# Altium project MIXR Input System.PrjPcb
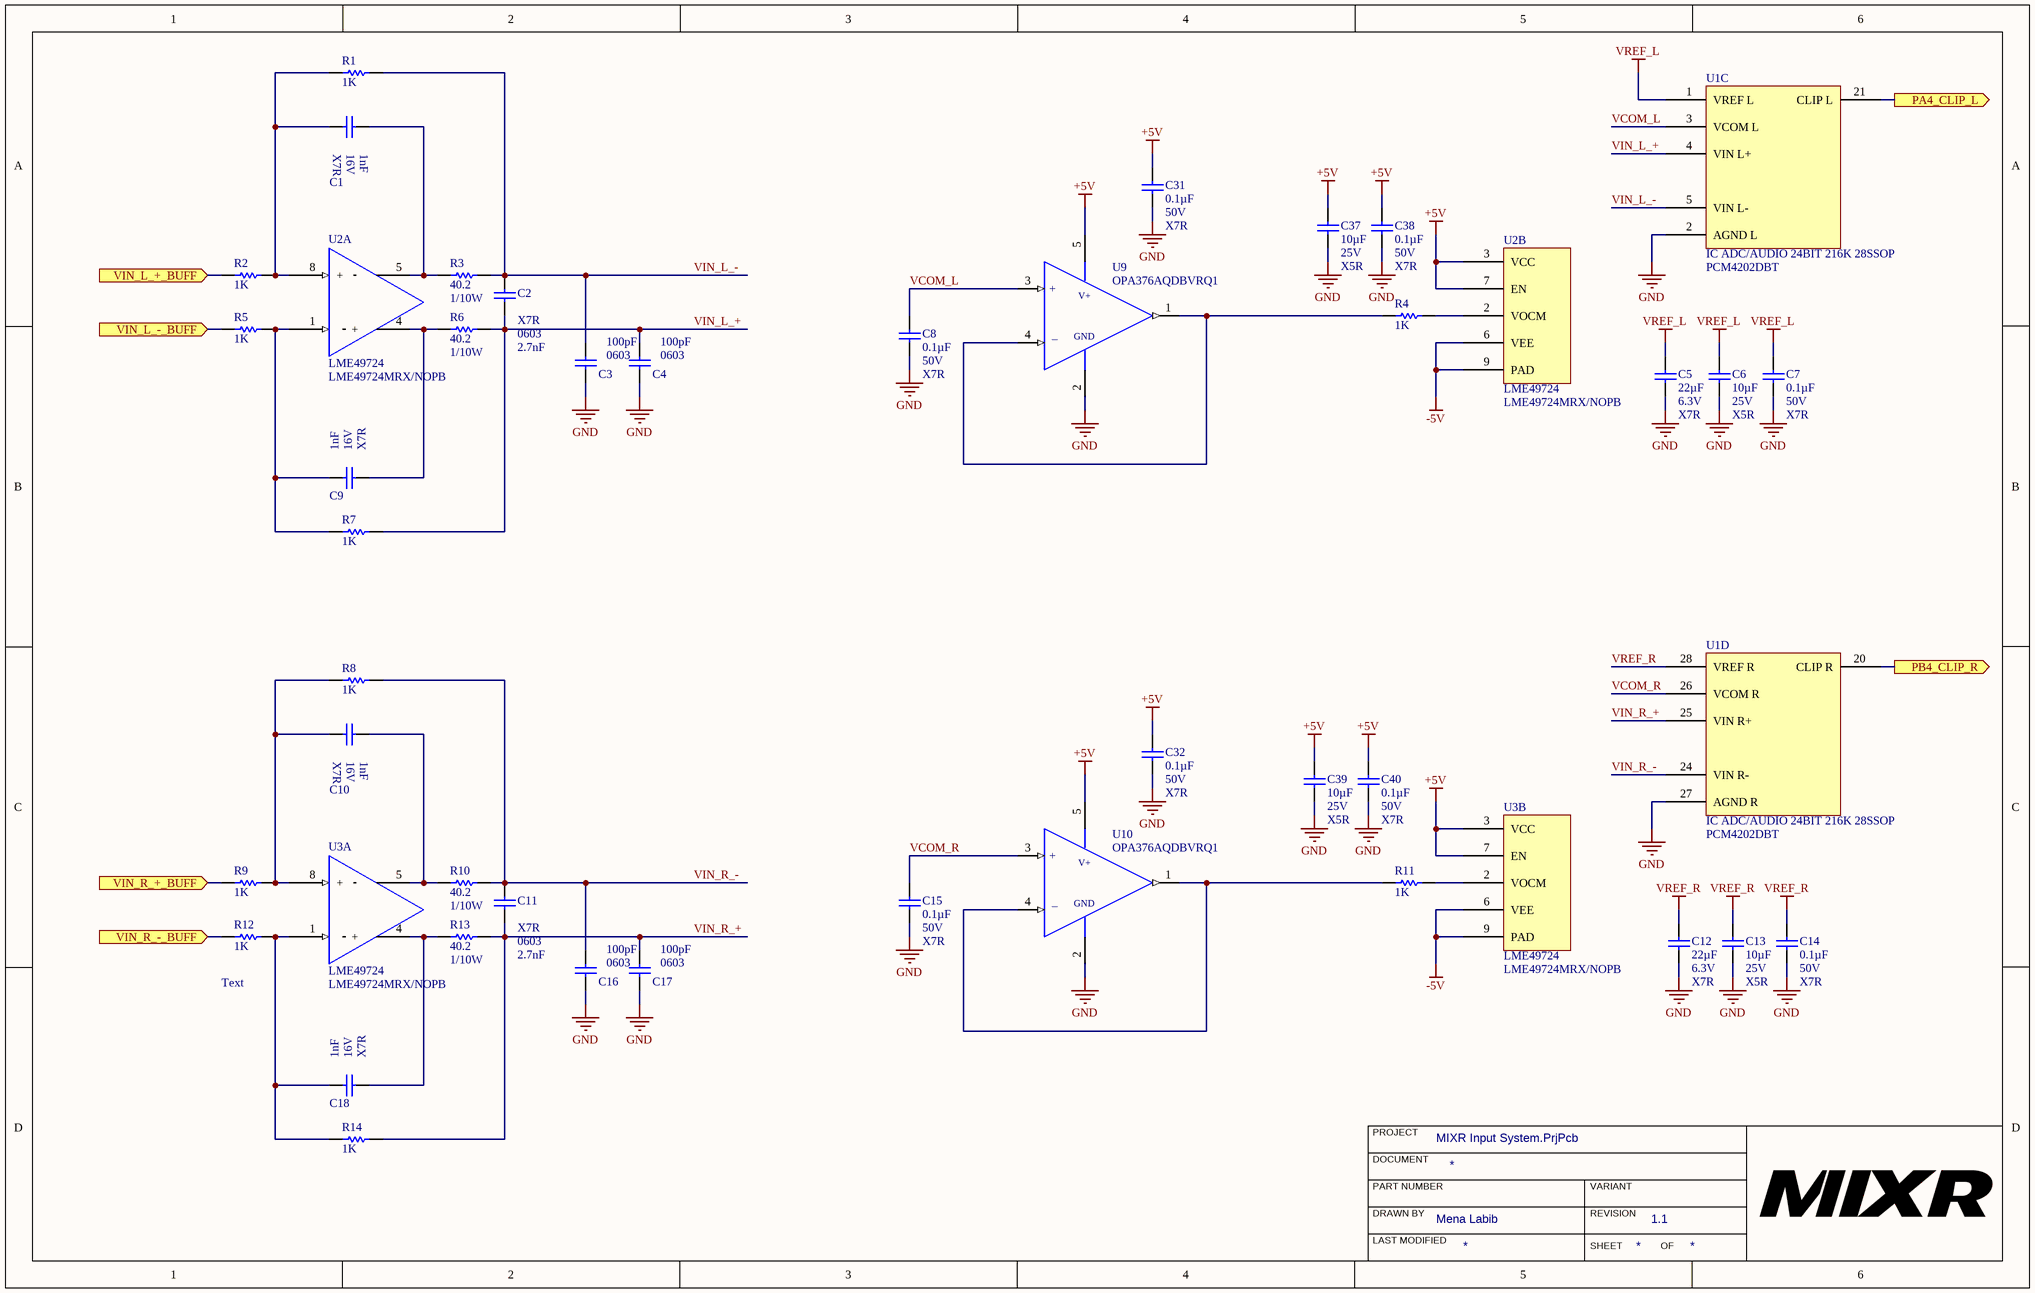
[diagram p0: MIXR Input System - Buffer.SchDoc]
ProjectRevision: 1.1; ProjectAuthor: Mena Labib
2 sheets, 69 parts. Net scope: flat (ports and power ports of the same name join across sheets).
Board file: MIXR Input System.PcbDoc
Sheets:
  MIXR Input System - Buffer.SchDoc
  MIXR Input System - input.SchDoc

## Sheet MIXR Input System - Buffer.SchDoc
size B

### Parts
C1  CAP CER 1NF 16V 10% X7R 0603  [CAP, 0603]  (value not drawn)
C2  Dielectric: X7R  Case Code (Imperial): 0603  Capacitance: 2.7nF  [CAP, 0603]  (hidden comment: CAP CER 2700PF 50V X7R 0603)
C3  Case Code (Imperial): 0603  Capacitance: 100pF  [CAP, 0603]  (hidden comment: CAP CER 100PF 50V C0G/NP0 0603)
C4  Case Code (Imperial): 0603  Capacitance: 100pF  [CAP, 0603]  (hidden comment: CAP CER 100PF 50V C0G/NP0 0603)
C5  Capacitance: 22µF  Voltage: 6.3V  Temperature Coefficient: X7R  [CAP, 1206]  (hidden comment: CAP CER 22UF 6.3V ±10% X7R 1206)
C6  Capacitance: 10µF  Voltage: 25V  Temperature Coefficient: X5R  [CAP, 0603]  (hidden comment: CAP CER 10uF 25V 20% X5R 0603)
C7  Capacitance: 0.1µF  Voltage: 50V  Temperature Coefficient: X7R  [CAP, 0603]  (hidden comment: CAP CER 0.1UF 50V 10% X7R 0603)
C8  Capacitance: 0.1µF  Voltage: 50V  Temperature Coefficient: X7R  [CAP, 0603]  (hidden comment: CAP CER 0.1UF 50V 10% X7R 0603)
C9  CAP CER 1NF 16V 10% X7R 0603  [CAP, 0603]  (value not drawn)
C10  CAP CER 1NF 16V 10% X7R 0603  [CAP, 0603]  (value not drawn)
C11  Dielectric: X7R  Case Code (Imperial): 0603  Capacitance: 2.7nF  [CAP, 0603]  (hidden comment: CAP CER 2700PF 50V X7R 0603)
C12  Capacitance: 22µF  Voltage: 6.3V  Temperature Coefficient: X7R  [CAP, 1206]  (hidden comment: CAP CER 22UF 6.3V ±10% X7R 1206)
C13  Capacitance: 10µF  Voltage: 25V  Temperature Coefficient: X5R  [CAP, 0603]  (hidden comment: CAP CER 10uF 25V 20% X5R 0603)
C14  Capacitance: 0.1µF  Voltage: 50V  Temperature Coefficient: X7R  [CAP, 0603]  (hidden comment: CAP CER 0.1UF 50V 10% X7R 0603)
C15  Capacitance: 0.1µF  Voltage: 50V  Temperature Coefficient: X7R  [CAP, 0603]  (hidden comment: CAP CER 0.1UF 50V 10% X7R 0603)
C16  Case Code (Imperial): 0603  Capacitance: 100pF  [CAP, 0603]  (hidden comment: CAP CER 100PF 50V C0G/NP0 0603)
C17  Case Code (Imperial): 0603  Capacitance: 100pF  [CAP, 0603]  (hidden comment: CAP CER 100PF 50V C0G/NP0 0603)
C18  CAP CER 1NF 16V 10% X7R 0603  [CAP, 0603]  (value not drawn)
C31  Capacitance: 0.1µF  Voltage: 50V  Temperature Coefficient: X7R  [CAP, 0603]  (hidden comment: CAP CER 0.1UF 50V 10% X7R 0603)
C32  Capacitance: 0.1µF  Voltage: 50V  Temperature Coefficient: X7R  [CAP, 0603]  (hidden comment: CAP CER 0.1UF 50V 10% X7R 0603)
C37  Capacitance: 10µF  Voltage: 25V  Temperature Coefficient: X5R  [CAP, 0603]  (hidden comment: CAP CER 10uF 25V 20% X5R 0603)
C38  Capacitance: 0.1µF  Voltage: 50V  Temperature Coefficient: X7R  [CAP, 0603]  (hidden comment: CAP CER 0.1UF 50V 10% X7R 0603)
C39  Capacitance: 10µF  Voltage: 25V  Temperature Coefficient: X5R  [CAP, 0603]  (hidden comment: CAP CER 10uF 25V 20% X5R 0603)
C40  Capacitance: 0.1µF  Voltage: 50V  Temperature Coefficient: X7R  [CAP, 0603]  (hidden comment: CAP CER 0.1UF 50V 10% X7R 0603)
R1  1K  [RES, 0603]
R2  1K  [RES, 0603]
R3  Resistance: 40.2  Power: 1/10W  [RES, 0603]  (hidden comment: RES 40.2 OHM 0.5% 1/10W 0603)
R4  1K  [RES, 0603]
R5  1K  [RES, 0603]
R6  Resistance: 40.2  Power: 1/10W  [RES, 0603]  (hidden comment: RES 40.2 OHM 0.5% 1/10W 0603)
R7  1K  [RES, 0603]
R8  1K  [RES, 0603]
R9  1K  [RES, 0603]
R10  Resistance: 40.2  Power: 1/10W  [RES, 0603]  (hidden comment: RES 40.2 OHM 0.5% 1/10W 0603)
R11  1K  [RES, 0603]
R12  1K  [RES, 0603]
R13  Resistance: 40.2  Power: 1/10W  [RES, 0603]  (hidden comment: RES 40.2 OHM 0.5% 1/10W 0603)
R14  1K  [RES, 0603]
U1  IC ADC/AUDIO 24BIT 216K 28SSOP  Manufacturer Part Number: PCM4202DBT  [IC ADC 24 BIT AUDIO 216 KHZ SSOP-28]  (parts C,D of 4)
U2  LME49724  Manufacturer Part Number: LME49724MRX/NOPB  [IC OP AMP AUDIO LME49724 8-SOIC]  (parts A,B of 2)
U3  LME49724  Manufacturer Part Number: LME49724MRX/NOPB  [IC OP AMP AUDIO LME49724 8-SOIC]  (parts A,B of 2)
U9  Manufacturer Part Number: OPA376AQDBVRQ1  [IC OP AMP GP RR 10MHZ SOT-23-5]  (hidden comment: IC OP AMP GEN PURPOSE RR 5.5MHZ SOT-23-5)
U10  Manufacturer Part Number: OPA376AQDBVRQ1  [IC OP AMP GP RR 10MHZ SOT-23-5]  (hidden comment: IC OP AMP GEN PURPOSE RR 5.5MHZ SOT-23-5)

### Ports
PA4_CLIP_L (out), PB4_CLIP_R (out), VIN_L_+_BUFF (in), VIN_L_-_BUFF (in), VIN_R_+_BUFF (in), VIN_R_-_BUFF (in)

### Nets
+5V: C31.1 C32.1 C37.1 C38.1 C39.1 C40.1 U2.3(VCC) U2.7(EN) U3.3(VCC) U3.7(EN) U9.5(VDD) U10.5(VDD)
-5V: U2.6(VEE) U2.9(PAD) U3.6(VEE) U3.9(PAD)
GND: C3.2 C4.2 C5.2 C6.2 C7.2 C8.2 C12.2 C13.2 C14.2 C15.2 C16.2 C17.2 C31.2 C32.2 C37.2 C38.2 C39.2 C40.2 U1.2(AGND_L) U1.27(AGND_R) U9.2(VSS) U10.2(VSS)
VREF_L: C5.1 C6.1 C7.1 U1.1(VREF_L)
VREF_R: C12.1 C13.1 C14.1 U1.28(VREF_R)
PA4: U1.21(CLIP_L) ; port PA4_CLIP_L
PB4: U1.20(CLIP_R) ; port PB4_CLIP_R
VCOM_L: C8.1 U1.3(VCOM_L) U9.3(+IN)
VCOM_R: C15.1 U1.26(VCOM_R) U10.3(+IN)
VIN_L_+: C2.2 C4.1 R6.2 R7.2 U1.4(VIN_L+)
VIN_L_+_BUFF: R2.1 ; port VIN_L_+_BUFF
VIN_L_-: C2.1 C3.1 R1.2 R3.2 U1.5(VIN_L-)
VIN_L_-_BUFF: R5.1 ; port VIN_L_-_BUFF
VIN_R_+: C11.2 C17.1 R13.2 R14.2 U1.25(VIN_R+)
VIN_R_+_BUFF: R9.1 ; port VIN_R_+_BUFF
VIN_R_-: C11.1 C16.1 R8.2 R10.2 U1.24(VIN_R-)
VIN_R_-_BUFF: R12.1 ; port VIN_R_-_BUFF
NetC1_1: C1.1 R3.1 U2.5(-)
NetC1_2: C1.2 R1.1 R2.2 U2.8(+)
NetC9_1: C9.1 R5.2 R7.1 U2.1(-)
NetC9_2: C9.2 R6.1 U2.4(+)
NetC10_1: C10.1 R10.1 U3.5(-)
NetC10_2: C10.2 R8.1 R9.2 U3.8(+)
NetC18_1: C18.1 R12.2 R14.1 U3.1(-)
NetC18_2: C18.2 R13.1 U3.4(+)
NetR4_1: R4.1 U9.1(OUTPUT) U9.4(-IN)
NetR4_2: R4.2 U2.2(VOCM)
NetR11_1: R11.1 U10.1(OUTPUT) U10.4(-IN)
NetR11_2: R11.2 U3.2(VOCM)

### Notes on the sheet
- (near R12) Text
- PROJECT
- DOCUMENT
- DRAWN BY
- LAST MODIFIED
- PART NUMBER
- REVISION
- SHEET
- VARIANT
- OF
- (in symbol CAP CER 1NF 16V 10% X7R 0603) X7R; 16V; 1nF
- (in symbol IC OP AMP GEN PURPOSE RR 5.5MHZ SOT-23-5) +; V+; GND; _

### Library data of the parts
C1 C9 C10 C18 = CAP CER 1NF 16V 10% X7R 0603: 1000pF ±10% 16V Ceramic Capacitor X7R 0603 (1608 Metric); Manufacturer: KEMET; Manufacturer Part Number: C0603C102K4RECAUTO; Supplier 1: Digi-Key; RoHS: No; Stock 1: 7692; Pricing 1: 1 = 0.19000, 10 = 0.13200, 100 = 0.06210, 500 = 0.04356, 1000 = 0.03606 (USD); ComponentLink1URL: https://api.kemet.com/component-edge/download/datasheet/C0603C102K4RECAUTO.pdf?src-supplier=Digi-Key; ComponentLink1Description: https://api.kemet.com/component-edge/download/datasheet/C0603C102K4RECAUTO.pdf?src-supplier=Digi-Key; Supplier Part Number 1: 399-17878-1-ND
C2 C11 = CAP CER 2700PF 50V X7R 0603: 2700pF ±10% 50V Ceramic Capacitor X7R 0603 (1608 Metric); Manufacturer: KEMET; Manufacturer Part Number: C0603C272K5RACTU; Supplier 1: Digi-Key; RoHS: Yes; Stock 1: 166011; Pricing 1: 1 = 0.11000, 10 = 0.08200, 100 = 0.03660, 500 = 0.02614, 1000 = 0.02054 (USD); Mount: Surface Mount; Case/Package: 0603; Number of Pins: 2; Case Code (Metric): 1608; Dielectric Material: Ceramic; Min Operating Temperature: -55°C; Max Operating Temperature: 125°C; Voltage Rating: 50V; Tolerance: 10%; Packaging: Tape and Reel; Voltage Rating (DC): 50V; Package Quantity: 1; Termination: SMD/SMT; Voltage: 50V; Length: 1.6mm; Height: 0.8mm; Width: 0.031inch; Thickness: 0.034inch; Lead Pitch: 0.7mm; Depth: 0.8mm; Radiation Hardening: No; REACH SVHC: No SVHC; ComponentLink1URL: https://datasheet.ciiva.com/18192/getdatasheetpartid-321287-18192955.pdf?src-supplier=Verical; ComponentLink1Description: https://datasheet.ciiva.com/18192/getdatasheetpartid-321287-18192955.pdf?src-supplier=Verical; ComponentLink2URL: https://datasheet.ciiva.com/7823/1633156-7823726.pdf?src-supplier=Element14; ComponentLink2Description: https://datasheet.ciiva.com/7823/1633156-7823726.pdf?src-supplier=Element14; ComponentLink3URL: https://datasheet.ciiva.com/7823/1633156-7823727.pdf?src-supplier=Element14; ComponentLink3Description: https://datasheet.ciiva.com/7823/1633156-7823727.pdf?src-supplier=Element14; Supplier Part Number 1: 399-7890-1-ND
C3 C4 C16 C17 = CAP CER 100PF 50V C0G/NP0 0603: 100pF ±1% 50V Ceramic Capacitor C0G, NP0 0603 (1608 Metric); Manufacturer: Kyocera AVX; Manufacturer Part Number: 06035A101FAT2A; Supplier 1: Digi-Key; Stock 1: 176069; Pricing 1: 1=0.24, 10=0.161, 100=0.0814, 500=0.0557, 1000=0.0493 (USD); Mount: Surface Mount; Case/Package: 0603; Case Code (Metric): 1608; Min Operating Temperature: -55°C; Max Operating Temperature: 125°C; Tolerance: 1%; Packaging: Tape and Reel; Voltage Rating: 50V; Package Quantity: 1; Voltage Rating (DC): 50V; Dielectric: C0G; Termination: SMD/SMT; Voltage: 50V; Length: 1.6mm; Height: 0.86mm; Width: 0.81mm; Thickness: 0.035inch; Depth: 0.81mm; Radiation Hardening: No; REACH SVHC: No SVHC; Lead Free: Lead Free; ComponentLink1URL: https://datasheet.ciiva.com/22682/1796416-22682854.pdf; ComponentLink1Description: https://datasheet.ciiva.com/22682/1796416-22682854.pdf; ComponentLink2URL: https://datasheet.ciiva.com/150/ccog-150746.pdf; ComponentLink2Description: https://datasheet.ciiva.com/150/ccog-150746.pdf; ComponentLink3URL: https://datasheet.ciiva.com/150/ccog-150747.pdf; ComponentLink3Description: https://datasheet.ciiva.com/150/ccog-150747.pdf; ComponentLink4URL: https://datasheet.ciiva.com/150/ccog-150748.pdf; ComponentLink4Description: https://datasheet.ciiva.com/150/ccog-150748.pdf; ComponentLink5URL: https://datasheet.ciiva.com/28585/1796416-28585980.pdf; ComponentLink5Description: https://datasheet.ciiva.com/28585/1796416-28585980.pdf; ComponentLink6URL: https://datasheet.ciiva.com/16300/ccog-16300413.pdf; ComponentLink6Description: https://datasheet.ciiva.com/16300/ccog-16300413.pdf; ComponentLink7URL: https://datasheet.ciiva.com/17492/ccog-17492189.pdf; ComponentLink7Description: https://datasheet.ciiva.com/17492/ccog-17492189.pdf; Supplier Part Number 1: 478-6202-1-ND
C5 C12 = CAP CER 22UF 6.3V ±10% X7R 1206: 22µF ±10% 6.3V Ceramic Capacitor X7R 1206 (3216 Metric); Manufacturer 1: Murata Electronics North America; Manufacturer Part Number 1: GRM31CR70J226KE19L; Supplier 1: Digi-Key; Supplier Part Number 1: 490-6515-1-ND; Packaging: Cut Tape (CT); Part Status: Active; Operating Temperature: -55°C ~ 125°C; Ratings: -; Mounting Type: Surface Mount, MLCC; Package / Case: 1206 (3216 Metric); Size / Dimension: 0.126" L x 0.063" W (3.20mm x 1.60mm); Height - Seated (Max): -; Thickness (Max): 0.071" (1.80mm); Lead Spacing: -; Lead Style: -; ComponentLink1URL: http://www.murata.com/~/media/webrenewal/support/library/catalog/products/capacitor/mlcc/c02e.ashx; ComponentLink1Description: http://www.murata.com/~/media/webrenewal/support/library/catalog/products/capacitor/mlcc/c02e.ashx; Tolerance: ±10%
C6 C13 C37 C39 = CAP CER 10uF 25V 20% X5R 0603: 10µF ±20% 25V Ceramic Capacitor X5R 0603 (1608 Metric); Manufacturer 1: Murata Electronics North America; Manufacturer Part Number 1: GRM188R61E106MA73D; Supplier 1: Digi-Key; Supplier Part Number 1: 490-7202-1-ND; Packaging: Cut Tape (CT); Part Status: Active; Operating Temperature: -55°C ~ 85°C; Ratings: -; Mounting Type: Surface Mount, MLCC; Package / Case: 0603 (1608 Metric); Size / Dimension: 0.063" L x 0.031" W (1.60mm x 0.80mm); Height - Seated (Max): -; Thickness (Max): 0.031" (0.80mm); Lead Spacing: -; Lead Style: -; ComponentLink1URL: http://www.murata.com/~/media/webrenewal/support/library/catalog/products/capacitor/mlcc/c02e.ashx; ComponentLink1Description: http://www.murata.com/~/media/webrenewal/support/library/catalog/products/capacitor/mlcc/c02e.ashx; Tolerance: ±20%
C7 C8 C14 C15 C31 C32 C38 C40 = CAP CER 0.1UF 50V 10% X7R 0603: 0.10µF ±10% 50V Ceramic Capacitor X7R 0603 (1608 Metric); Manufacturer 1: AVX Corporation; Manufacturer Part Number 1: 06035C104KAT2A; Supplier 1: Digi-Key; Supplier Part Number 1: 478-5052-1-ND; Packaging: Cut Tape (CT); Part Status: Active; Operating Temperature: -55°C ~ 125°C; Ratings: -; Mounting Type: Surface Mount, MLCC; Package / Case: 0603 (1608 Metric); Size / Dimension: 0.063" L x 0.032" W (1.60mm x 0.81mm); Height - Seated (Max): -; Thickness (Max): 0.035" (0.90mm); Lead Spacing: -; Lead Style: -; ComponentLink1URL: http://datasheets.avx.com/X7RDielectric.pdf; ComponentLink1Description: http://datasheets.avx.com/X7RDielectric.pdf; Tolerance: ±10%
R1 R2 R4 R5 R7-R9 R11 R12 R14 = RES 1K OHM 5% 1/10W 0603: 1k Ohm ±5% 0.1W, 1/10W Chip Resistor 0603 (1608 Metric); Manufacturer: Yageo; Manufacturer Part Number: RC0603JR-071KL; Temperature Coefficient: ±100ppm/°C; Supplier 1: Digi-Key; Supplier Part Number 1: 311-1.0KGRCT-ND; RoHS: RoHS Compliant; Category: Resistors; Stock 1: 4415240; Pricing 1: 1=0.15, 10=0.017, 100=0.0071, 1000=0.0032, 2500=0.00278 (CAD); Packaging: Cut Tape (CT); Part Status: Active; Resistance (Ohms): 1k; Tolerance: ±5%; Power (Watts): 0.1W, 1/10W; Composition: Thick Film; Features: Moisture Resistant; Operating Temperature: -55°C ~ 155°C; Package / Case: 0603 (1608 Metric); Supplier Device Package: 0603; Size / Dimension: 0.063" L x 0.031" W (1.60mm x 0.80mm); Height - Seated (Max): 0.022" (0.55mm); Failure Rate: -; ComponentLink1URL: http://www.yageo.com/documents/recent/PYu-RC_Group_51_RoHS_L_7.pdf; ComponentLink1Description: http://www.yageo.com/documents/recent/PYu-RC_Group_51_RoHS_L_7.pdf
R3 R6 R10 R13 = RES 40.2 OHM 0.5% 1/10W 0603: RES SMD 40.2 OHM 0.5% 1/10W 0603; Manufacturer 1: Yageo; Manufacturer Part Number 1: RT0603DRE0740R2L; Temperature Coefficient: ±50ppm/°C; Supplier 1: Digi-Key; Supplier Part Number 1: 311-2576-1-ND; Packaging: Cut Tape (CT); Part Status: Active; Composition: Thin Film; Operating Temperature: -55°C ~ 155°C; Package / Case: 0603 (1608 Metric); Supplier Device Package: 0603; Size / Dimension: 0.063" L x 0.031" W (1.60mm x 0.80mm); Height - Seated (Max): 0.022" (0.55mm); Failure Rate: -; ComponentLink1URL: http://www.yageo.com/documents/recent/PYu-RT_1-to-0.01_RoHS_L_7.pdf; ComponentLink1Description: http://www.yageo.com/documents/recent/PYu-RT_1-to-0.01_RoHS_L_7.pdf; Tolerance: ±0.5%
U1 = IC ADC 24 BIT AUDIO 216KHZ SSOP-28: ADC, Audio 24 bit 216k DSP, PCM 28-SSOP; Manufacturer: Texas Instruments; Operating Supply Voltage: 5V; Interface: Serial; Number of Bits: 24; Sampling Rate: 216KS/s; Number of A/D Converters: 2; Max Power Dissipation: 408mW; Max Supply Voltage: 5.25V; Min Supply Voltage: 4.75V; Nominal Supply Current: 55mA; Power Consumption: 338mW; Resolution: 24b; Polarity: Bipolar; Number of Analog Inputs: 1; Supply Type: Analog; Number of DAC Channels: 0; Supplier 1: Digi-Key; Supplier Part Number 1: 296-17438-1-ND; Stock 1: 5943; Pricing 1: 1 = 9.85000, 10 = 8.89800, 100 = 7.36660 (USD); RoHS: Yes; Mount: Surface Mount; Case/Package: SSOP; Number of Pins: 28; Weight: 0.008529oz; Min Operating Temperature: -10°C; Max Operating Temperature: 70°C; Package Quantity: 250; Packaging: Tape and Reel; Number of Converters: 2; Number of Elements: 2; Power Dissipation: 408mW; Conversion Rate: 216KS/s; Number of ADC Channels: 2; Length: 10.2mm; Height: 1.95mm; Width: 5.3mm; Radiation Hardening: No; Lead Free: Lead Free; REACH SVHC: No SVHC; ComponentLink1URL: https://datasheet.ciiva.com/25988/sbas290b-25988737.pdf?src-supplier=Avnet+Europe; ComponentLink1Description: https://datasheet.ciiva.com/25988/sbas290b-25988737.pdf?src-supplier=Avnet+Europe; ComponentLink2URL: https://datasheet.ciiva.com/41460/001186374-da-01-en-ic-adc-stereo-24b-pcm4202dbt-ssop-28-tid-41460403.pdf?src-supplier=Conrad; ComponentLink2Description: https://datasheet.ciiva.com/41460/001186374-da-01-en-ic-adc-stereo-24b-pcm4202dbt-ssop-28-tid-41460403.pdf?src-supplier=Conrad; ComponentLink3URL: https://datasheet.ciiva.com/26800/pcm4202dbt-26800794.pdf?src-supplier=IIIC; ComponentLink3Description: https://datasheet.ciiva.com/26800/pcm4202dbt-26800794.pdf?src-supplier=IIIC; ComponentLink4URL: https://datasheet.ciiva.com/29896/sbas290b-29896124.pdf?src-supplier=Avnet; ComponentLink4Description: https://datasheet.ciiva.com/29896/sbas290b-29896124.pdf?src-supplier=Avnet; ComponentLink5URL: https://datasheet.ciiva.com/1307/pcm4202-1307121.pdf?src-supplier=Digi-Key; ComponentLink5Description: https://datasheet.ciiva.com/1307/pcm4202-1307121.pdf?src-supplier=Digi-Key; ComponentLink6URL: https://datasheet.ciiva.com/1307/pcm4202-1307122.pdf?src-supplier=Digi-Key; ComponentLink6Description: https://datasheet.ciiva.com/1307/pcm4202-1307122.pdf?src-supplier=Digi-Key; ComponentLink7URL: https://datasheet.ciiva.com/1307/pcm4202-1307123.pdf?src-supplier=Digi-Key; ComponentLink7Description: https://datasheet.ciiva.com/1307/pcm4202-1307123.pdf?src-supplier=Digi-Key; ComponentLink8URL: https://datasheet.ciiva.com/15147/getdatasheetpartid-171631-15147899.pdf?src-supplier=Verical; ComponentLink8Description: https://datasheet.ciiva.com/15147/getdatasheetpartid-171631-15147899.pdf?src-supplier=Verical
U2 U3 = IC OP AMP AUDIO LME49724 8-SOIC: Audio Amplifier 1 Circuit Differential 8-SO PowerPad; Manufacturer: TI National Semiconductor; Max Supply Voltage: 36V; Min Supply Voltage: 5V; Voltage Gain: 125dB; Unity Gain Bandwidth Product: 50MHz; Slew Rate: 18V/µs; Common Mode Rejection Ratio: 95dB; Min Dual Supply Voltage: 2.5V; Max Dual Supply Voltage: 18V; Output Current: 80mA; Number of Circuits: 1; Input Bias Current: 60nA; Input Offset Voltage (Vos): 200uV; Operating Supply Current: 10mA; Supplier 1: Digi-Key; Supplier Part Number 1: 296-37390-1-ND; Stock 1: 17947; Pricing 1: 1 = 2.67000, 10 = 2.40200, 100 = 1.93060, 500 = 1.58620, 1000 = 1.31428 (USD); RoHS: Yes; Mount: Surface Mount; Number of Pins: 8; Contact Plating: Tin; Min Operating Temperature: -40°C; Max Operating Temperature: 85°C; Packaging: Tape and Reel; Package Quantity: 2500; Gain Bandwidth Product: 50MHz; Output Current per Channel: 80mA; Number of Channels: 1; Number of Elements: 1; Power Supply Rejection Ratio (PSRR): 95dB; Radiation Hardening: No; Lead Free: Lead Free; ComponentLink1URL: https://datasheet.ciiva.com/29638/lme49724-29638149.pdf?src-supplier=Digi-Key; ComponentLink1Description: https://datasheet.ciiva.com/29638/lme49724-29638149.pdf?src-supplier=Digi-Key; ComponentLink2URL: https://datasheet.ciiva.com/29638/lme49724-29638731.pdf?src-supplier=Digi-Key; ComponentLink2Description: https://datasheet.ciiva.com/29638/lme49724-29638731.pdf?src-supplier=Digi-Key; ComponentLink3URL: https://datasheet.ciiva.com/1818/lme49724-1818445.pdf?src-supplier=Digi-Key; ComponentLink3Description: https://datasheet.ciiva.com/1818/lme49724-1818445.pdf?src-supplier=Digi-Key
U9 U10 = IC OP AMP GEN PURPOSE RR 5.5MHZ SOT-23-5: General Purpose Amplifier 1 Circuit Rail-to-Rail SOT-23-5; Manufacturer: Texas Instruments; Max Supply Voltage: 5.5V; Min Supply Voltage: 2.2V; Output Current: 30mA; Nominal Supply Current: 950uA; Voltage Gain: 134dB; Common Mode Rejection Ratio: 76dB; Number of Channels: 1; Slew Rate: 2V/µs; Max I/O Voltage: 25uV; Input Bias Current: 10pA; Operating Supply Current: 760uA; Output Current per Channel: 50mA; Power Supply Rejection Ratio (PSRR): 106.02dB; Supplier 1: Digi-Key; Stock 1: 26635; Pricing 1: 1 = 2.14000, 10 = 1.92200, 100 = 1.54450, 500 = 1.26896, 1000 = 1.05142 (USD); RoHS: Yes; Case/Package: SOT-23-5; Number of Pins: 5; Min Operating Temperature: -40°C; Max Operating Temperature: 125°C; Unity Gain Bandwidth Product: 5.5MHz; Packaging: Tape and Reel; Package Quantity: 3000; Number of Circuits: 1; Gain Bandwidth Product: 5.5MHz; Input Offset Voltage (Vos): 25uV; Number of Elements: 1; Radiation Hardening: No; Lead Free: Lead Free; ComponentLink1URL: http://www.ti.com/lit/ds/sbos549/sbos549.pdf?src-supplier=Avnet; ComponentLink1Description: http://www.ti.com/lit/ds/sbos549/sbos549.pdf?src-supplier=Avnet; Supplier Part Number 1: 296-36701-1-ND

## Sheet MIXR Input System - input.SchDoc
size B
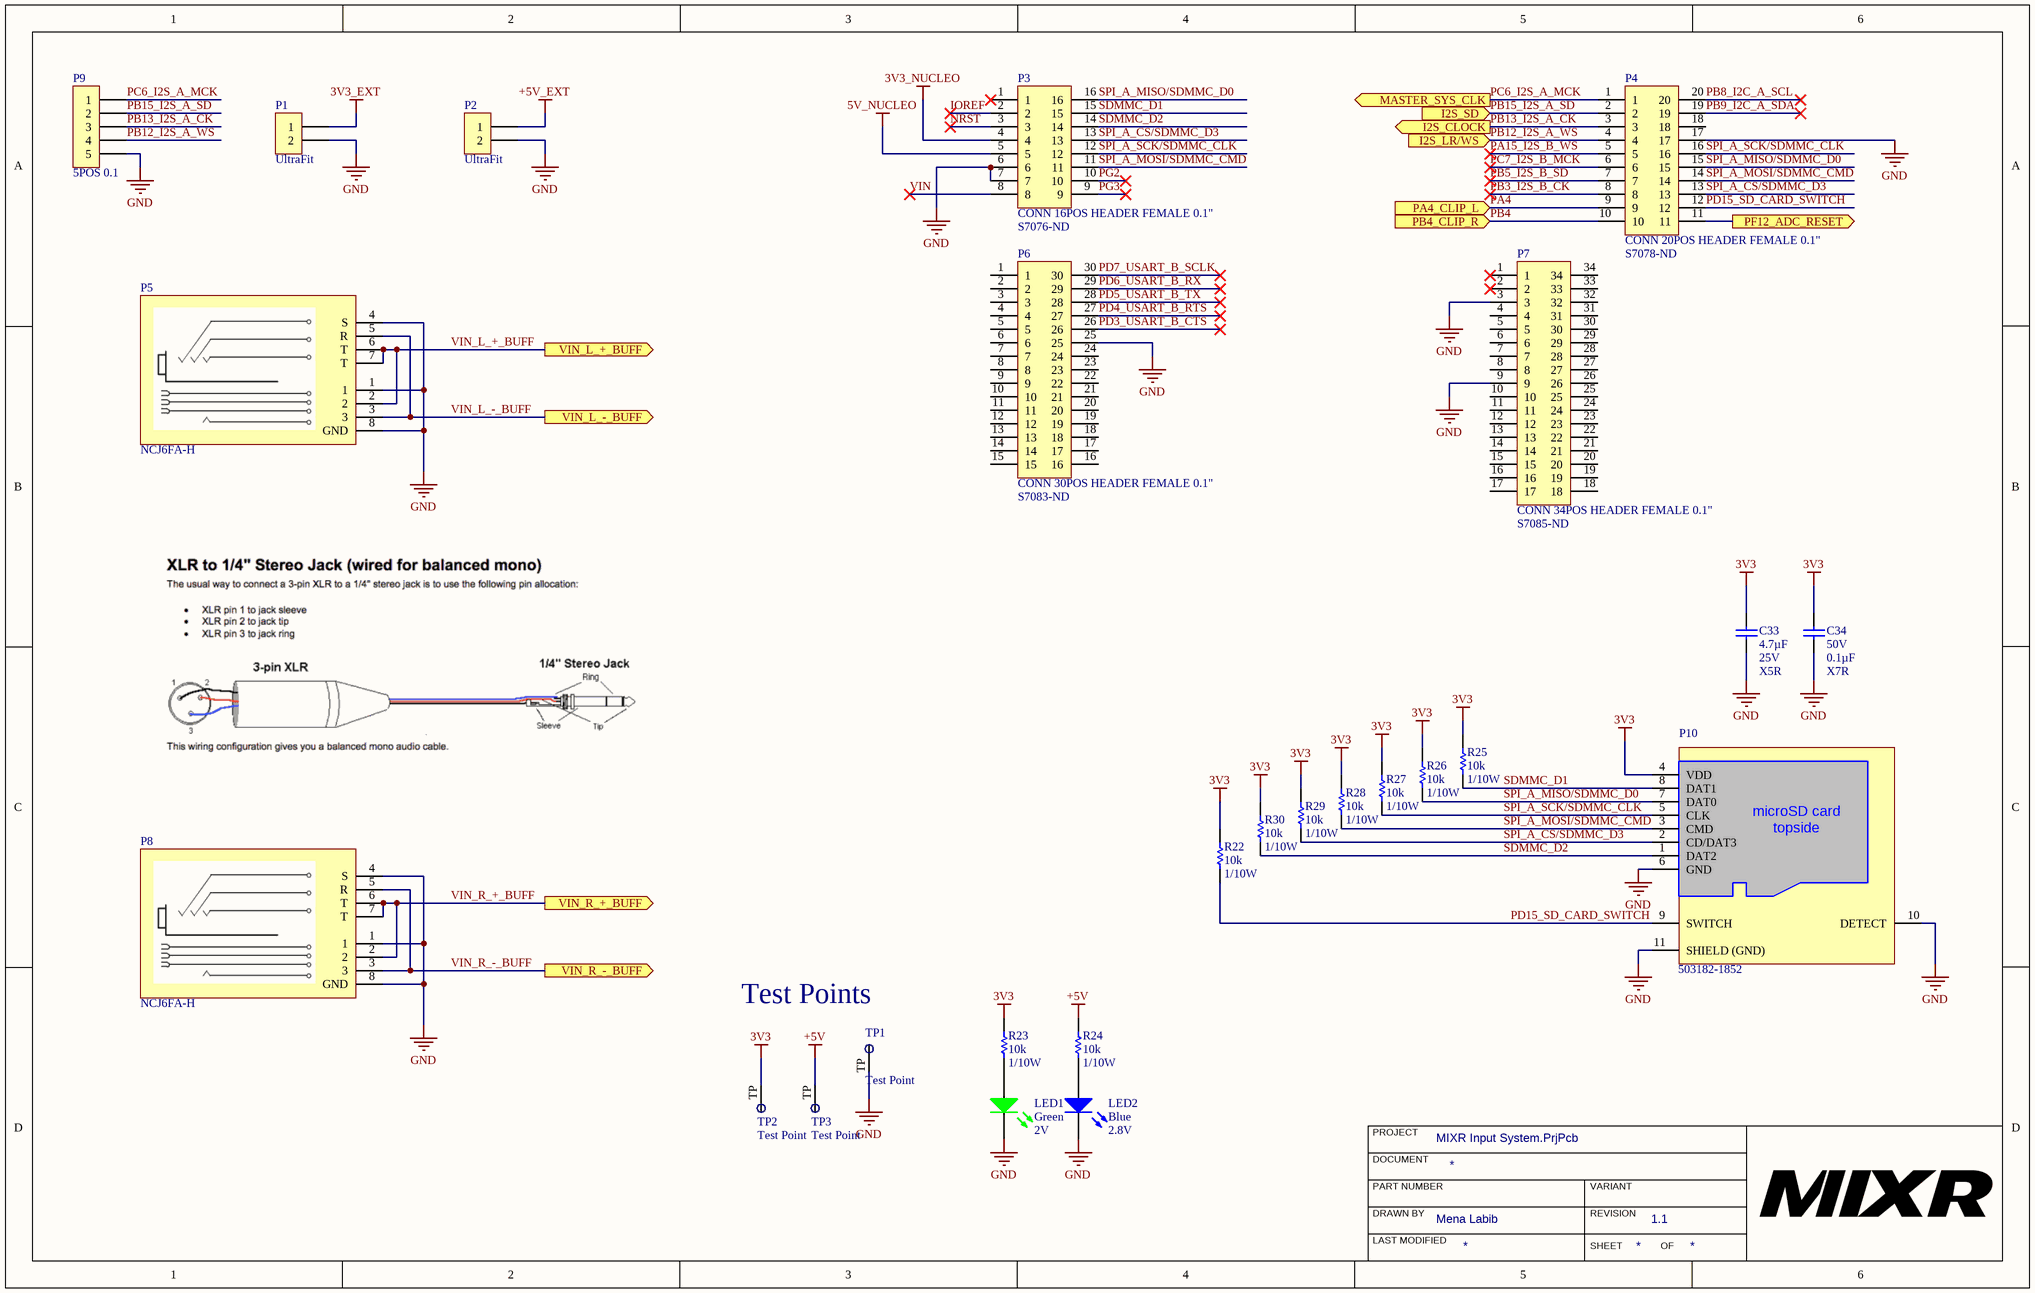
[diagram p1: MIXR Input System - input.SchDoc]

### Parts
C33  Capacitance: 4.7µF  Voltage: 25V  Temperature Coefficient: X5R  [CAP, 0603]  (hidden comment: CAP CER 4.7UF 25V 10% X5R 0603)
C34  Voltage: 50V  Capacitance: 0.1µF  Temperature Coefficient: X7R  [CAP, 0603]  (hidden comment: CAP CER 0.1UF 50V 10% X7R 0603)
LED1  Color: Green  Voltage - Forward (Vf) (Typ): 2V  [LED_0603]  (hidden comment: LED GREEN CLEAR 2V 0603)
LED2  Color: Blue  Voltage - Forward (Vf) (Typ): 2.8V  [LED_0603]  (hidden comment: LED BLUE CLEAR 2.8V 0603)
P1  Series: UltraFit  [CONN, 2POS ULTRA-FIT]  (hidden comment: CONN 2POS ULTRA-FIT 0.138")
P2  Series: UltraFit  [CONN, 2POS ULTRA-FIT]  (hidden comment: CONN 2POS ULTRA-FIT 0.138")
P3  CONN 16POS HEADER FEMALE 0.1"  Supplier Part Number 1: S7076-ND  [CONN, 16POS 0.100" Header]
P4  CONN 20POS HEADER FEMALE 0.1"  Supplier Part Number 1: S7078-ND  [CONN, 20POS 0.100" HEADER]
P5  Manufacturer Part Number: NCJ6FA-H  [CONN XLR-TRS COMBO 3 POLE]  (hidden comment: CONN XLR-TRS COMBO 3 POLE)
P6  CONN 30POS HEADER FEMALE 0.1"  Supplier Part Number 1: S7083-ND  [CONN, 30POS 0.100" HEADER]
P7  CONN 34POS HEADER FEMALE 0.1"  Supplier Part Number 1: S7085-ND  [CONN, 34POS 0.100" HEADER]
P8  Manufacturer Part Number: NCJ6FA-H  [CONN XLR-TRS COMBO 3 POLE]  (hidden comment: CONN XLR-TRS COMBO 3 POLE)
P9  5POS 0.1  [CONN, 5POS HEADR 0.1"]
P10  Manufacturer Part Number: 503182-1852  [CONN MICRO-SD HOLDER MOLEX 503182-1852]  (hidden comment: CONN MICRO-SD ULTRA-LOW 8CKT)
R22  Resistance: 10k  Power: 1/10W  [RES, 0603]  (hidden comment: RES 10K OHM 1% 1/10W 0603)
R23  Resistance: 10k  Power: 1/10W  [RES, 0603]  (hidden comment: RES 10K OHM 1% 1/10W 0603)
R24  Resistance: 10k  Power: 1/10W  [RES, 0603]  (hidden comment: RES 10K OHM 1% 1/10W 0603)
R25  Resistance: 10k  Power: 1/10W  [RES, 0603]  (hidden comment: RES 10K OHM 1% 1/10W 0603)
R26  Resistance: 10k  Power: 1/10W  [RES, 0603]  (hidden comment: RES 10K OHM 1% 1/10W 0603)
R27  Resistance: 10k  Power: 1/10W  [RES, 0603]  (hidden comment: RES 10K OHM 1% 1/10W 0603)
R28  Resistance: 10k  Power: 1/10W  [RES, 0603]  (hidden comment: RES 10K OHM 1% 1/10W 0603)
R29  Resistance: 10k  Power: 1/10W  [RES, 0603]  (hidden comment: RES 10K OHM 1% 1/10W 0603)
R30  Resistance: 10k  Power: 1/10W  [RES, 0603]  (hidden comment: RES 10K OHM 1% 1/10W 0603)
TP1  Test Point  [Test Point]  (no BOM)
TP2  Test Point  [Test Point]  (no BOM)
TP3  Test Point  [Test Point]  (no BOM)

### Ports
I2S_CLOCK (out), I2S_LR/WS (in), I2S_SD (in), MASTER_SYS_CLK (out), PA4_CLIP_L (in), PB4_CLIP_R (in), PF12_ADC_RESET (out), VIN_L_+_BUFF (out), VIN_L_-_BUFF (out), VIN_R_+_BUFF (out), VIN_R_-_BUFF (out)

### Nets
3V3: C33.1 C34.2 P10.4(VDD) R22.2 R23.1 R25.2 R26.2 R27.2 R28.2 R29.2 R30.2 TP2.TP
3V3_EXT: P1.1
3V3_NUCLEO: P3.4
5V_NUCLEO: P3.5
+5V: R24.1 TP3.TP
+5V_EXT: P2.1
GND: C33.2 C34.1 LED1.2(K) LED2.2(K) P1.2 P2.2 P3.6 P3.7 P4.17 P5.1 P5.4(S) P5.8(GND) P6.25 P7.3 P7.9 P8.1 P8.4(S) P8.8(GND) P9.5 P10.6(GND) P10.10(DETECT) P10.11(SHIELD_(GND)) TP1.TP
IOREF: P3.2
NRST: P3.3
PA4: P4.9 ; port PA4_CLIP_L
PA15_I2S_B_WS: P4.5
PB3_I2S_B_CK: P4.8
PB4: P4.10 ; port PB4_CLIP_R
PB5_I2S_B_SD: P4.7
PB8_I2C_A_SCL: P4.20
PB9_I2C_A_SDA: P4.19
PB12_I2S_A_WS: P4.4 P9.4 ; port I2S_LR/WS
PB13_I2S_A_CK: P4.3 P9.3 ; port I2S_CLOCK
PB15_I2S_A_SD: P4.2 P9.2 ; port I2S_SD
PC6_I2S_A_MCK: P4.1 P9.1 ; port MASTER_SYS_CLK
PC7_I2S_B_MCK: P4.6
PD3_USART_B_CTS: P6.26
PD4_USART_B_RTS: P6.27
PD5_USART_B_TX: P6.28
PD6_USART_B_RX: P6.29
PD7_USART_B_SCLK: P6.30
PD15_SD_CARD_SWITCH: P4.12 P10.9(SWITCH) R22.1
PG2: P3.10
PG3: P3.9
SDMMC_D1: P3.15 P10.8(DAT1) R25.1
SDMMC_D2: P3.14 P10.1(DAT2) R30.1
SPI_A_CS/SDMMC_D3: P3.13 P4.13 P10.2(CD/DAT3) R29.1
SPI_A_MISO/SDMMC_D0: P3.16 P4.15 P10.7(DAT0) R26.1
SPI_A_MOSI/SDMMC_CMD: P3.11 P4.14 P10.3(CMD) R28.1
SPI_A_SCK/SDMMC_CLK: P3.12 P4.16 P10.5(CLK) R27.1
VIN: P3.8
VIN_L_+_BUFF: P5.2 P5.6(T) P5.7(T) ; port VIN_L_+_BUFF
VIN_L_-_BUFF: P5.3 P5.5(R) ; port VIN_L_-_BUFF
VIN_R_+_BUFF: P8.2 P8.6(T) P8.7(T) ; port VIN_R_+_BUFF
VIN_R_-_BUFF: P8.3 P8.5(R) ; port VIN_R_-_BUFF
NetLED1_1: LED1.1(A) R23.2
NetLED2_1: LED2.1(A) R24.2
NetP4_11: P4.11 ; port PF12_ADC_RESET

Not connected (* = marked no-connect by the designer): P3 1*; P4 18; P6 1 2 3 4 5 6 7 8 9 10 11 12 13 14 15 16 17 18 19 20 21 22 23 24; P7 1* 2* 4 5 6 7 8 10 11 12 13 14 15 16 17 18 19 20 21 22 23 24 25 26 27 28 29 30 31 32 33 34

### Notes on the sheet
- (near TP1) Test Points
- PROJECT
- DOCUMENT
- DRAWN BY
- LAST MODIFIED
- PART NUMBER
- REVISION
- SHEET
- VARIANT
- OF
- (in symbol CONN MICRO-SD ULTRA-LOW 8CKT) microSD card / topside

### Library data of the parts
C33 = CAP CER 4.7UF 25V 10% X5R 0603: 4.7µF ±10% 25V Ceramic Capacitor X5R 0603 (1608 Metric); Manufacturer 1: Murata Electronics North America; Manufacturer Part Number 1: GRM188R61E475KE11D; Supplier 1: Digi-Key; Supplier Part Number 1: 490-7203-1-ND; Packaging: Cut Tape (CT); Part Status: Active; Operating Temperature: -55°C ~ 85°C; Ratings: -; Mounting Type: Surface Mount, MLCC; Package / Case: 0603 (1608 Metric); Size / Dimension: 0.063" L x 0.031" W (1.60mm x 0.80mm); Height - Seated (Max): -; Thickness (Max): 0.031" (0.80mm); Lead Spacing: -; Lead Style: -; ComponentLink1URL: http://www.murata.com/~/media/webrenewal/support/library/catalog/products/capacitor/mlcc/c02e.ashx; ComponentLink1Description: http://www.murata.com/~/media/webrenewal/support/library/catalog/products/capacitor/mlcc/c02e.ashx; Tolerance: ±10%
C34 = CAP CER 0.1UF 50V 10% X7R 0603: as C7 on sheet MIXR Input System - Buffer; Supplier 1: Digi-Key; Supplier Part Number 1: 478-5052-1-ND; Packaging: Cut Tape (CT); Part Status: Active; Operating Temperature: -55°C ~ 125°C; Ratings: -; Mounting Type: Surface Mount, MLCC; Package / Case: 0603 (1608 Metric); Size / Dimension: 0.063" L x 0.032" W (1.60mm x 0.81mm); Height - Seated (Max): -; Thickness (Max): 0.035" (0.90mm); Lead Spacing: -; Lead Style: -; ComponentLink1URL: http://datasheets.avx.com/X7RDielectric.pdf; ComponentLink1Description: http://datasheets.avx.com/X7RDielectric.pdf; Tolerance: ±10%
LED1 = LED GREEN CLEAR 2V 0603: Green 572nm LED Indication - Discrete 2V 0603 (1608 Metric); Manufacturer: Wurth Electronics Inc.; Manufacturer Part Number: 150060VS75000; Lens Color: Colorless; Millicandela Rating: 40mcd; Lens Style/Size: Rectangle with Flat Top, 1.10mm x 0.70mm; Current - Test: 20mA; Viewing Angle: 140°; Wavelength - Dominant: 570nm; Supplier 1: Digi-Key; RoHS: RoHS Compliant; Category: Optoelectronics; Stock 1: 9408; Pricing 1: 1=0.21, 100=0.1617, 500=0.13964 (CAD); Packaging: Cut Tape (CT); Part Status: Active; Lens Transparency: Clear; Mounting Type: Surface Mount; Wavelength - Peak: 572nm; Features: -; Package / Case: 0603 (1608 Metric); Supplier Device Package: 0603; Size / Dimension: 1.60mm L x 0.80mm W; Height (Max): 0.80mm; ComponentLink1URL: http://katalog.we-online.de/led/datasheet/150060VS75000.pdf; ComponentLink1Description: http://katalog.we-online.de/led/datasheet/150060VS75000.pdf; Supplier Part Number 1: 732-4980-1-ND
LED2 = LED BLUE CLEAR 2.8V 0603: Blue 470nm LED Indication - Discrete 2.8V 0603 (1608 Metric); Manufacturer 1: Lite-On Inc.; Manufacturer Part Number 1: LTST-C193TBKT-5A; Lens Color: Colorless; Millicandela Rating: 15mcd; Lens Style/Size: Rectangle with Flat Top, 1.15mm x 0.80mm; Current - Test: 5mA; Viewing Angle: 130°; Wavelength - Peak: 468nm; Supplier 1: Digi-Key; Supplier Part Number 1: 160-1827-1-ND; Packaging: Cut Tape (CT); Part Status: Active; Lens Transparency: Clear; Mounting Type: Surface Mount; Wavelength - Dominant: 470nm; Package / Case: 0603 (1608 Metric); Supplier Device Package: Chip LED; Size / Dimension: 1.60mm L x 0.80mm W; Height (Max): 0.45mm; ComponentLink1URL: http://optoelectronics.liteon.com/upload/download/DS22-2004-060/P_100_LTST-C193TBKT-5A.pdf; ComponentLink1Description: http://optoelectronics.liteon.com/upload/download/DS22-2004-060/P_100_LTST-C193TBKT-5A.pdf
P1 P2 = CONN 2POS ULTRA-FIT 0.138": Connector Header Through Hole 2 position 0.138" (3.50mm); Manufacturer: Molex; Manufacturer Part Number: 1722871102; Number of Positions: 2; Connector Type: Male Pin; Pitch: 0.138inch; ComponentLink1URL: http://www.molex.com/pdm_docs/sd/1722861302_sd.pdf; ComponentLink1Description: http://www.molex.com/pdm_docs/sd/1722861302_sd.pdf; Supplier 1: Digi-Key; RoHS: Yes; Stock 1: 2743; Pricing 1: 1 = 0.78000, 10 = 0.68800, 100 = 0.59380, 500 = 0.48582, 1000 = 0.43184, 5000 = 0.37786, 10000 = 0.35897 (USD); Mount: Through Hole; Color: Black; Contact Plating: Tin; Packaging: Tray; Number of Rows: 1; Termination: Solder; Fastening Type: Latch; Supplier Part Number 1: WM11701-ND
P3 = CONN 16POS HEADER FEMALE 0.1": 16 Position Header Connector 0.100" (2.54mm) Through Hole Tin; Manufacturer: Sullins; Manufacturer Part Number: PPTC082LFBN-RC; Number of Positions: 16; Pitch: 0.1inch; Supplier 1: Digi-Key; RoHS: Yes; Stock 1: 4232; Pricing 1: 1 = 0.99000, 10 = 0.87000, 100 = 0.75040, 500 = 0.61398, 1000 = 0.54576, 5000 = 0.49270 (USD); Mount: Through Hole; Color: Black; Contact Plating: Tin; Contact Material: Bronze; Housing Material: Plastic; Package Quantity: 1000; Number of Rows: 2; Packaging: Bulk; Termination: Solder; Connector Type: Header; Length: 20.8mm; Height: 8.5mm; Row Spacing: 0.1inch; Width: 5mm; Lead Free: Lead Free; ComponentLink1URL: http://www.sullinscorp.com/catalogs/101_Page80-81_HEADER_.100_2.54mm_FEMALE.pdf?src-supplier=Future+Electronics; ComponentLink1Description: http://www.sullinscorp.com/catalogs/101_Page80-81_HEADER_.100_2.54mm_FEMALE.pdf?src-supplier=Future+Electronics; ComponentLink2URL: https://drawings-pdf.s3.amazonaws.com/10492.pdf?src-supplier=Digi-Key; ComponentLink2Description: https://drawings-pdf.s3.amazonaws.com/10492.pdf?src-supplier=Digi-Key
P4 = CONN 20POS HEADER FEMALE 0.1": 20 Position Header Connector 0.100" (2.54mm) Through Hole Tin; Manufacturer: Sullins; Manufacturer Part Number: PPTC102LFBN-RC; Number of Positions: 20; Pitch: 0.1inch; Supplier 1: Digi-Key; RoHS: Yes; Stock 1: 4161; Pricing 1: 1 = 1.30000, 10 = 1.14500, 100 = 0.98800, 500 = 0.80838, 1000 = 0.71856, 5000 = 0.64870 (USD); Mount: Through Hole; Color: Black; Contact Plating: Tin; Contact Material: Bronze; Housing Material: Plastic; Package Quantity: 1000; Number of Rows: 2; Packaging: Bulk; Termination: Solder; Connector Type: Header; Length: 25.9mm; Height: 8.5mm; Row Spacing: 0.1inch; Width: 5mm; Lead Free: Lead Free; ComponentLink1URL: http://www.sullinscorp.com/catalogs/101_Page80-81_HEADER_.100_2.54mm_FEMALE.pdf?src-supplier=Future+Electronics; ComponentLink1Description: http://www.sullinscorp.com/catalogs/101_Page80-81_HEADER_.100_2.54mm_FEMALE.pdf?src-supplier=Future+Electronics; ComponentLink2URL: https://media.digikey.com/pdf/Data%20Sheets/Sullins%20PDFs/Female_Headers.100_DS.pdf?src-supplier=Digi-Key; ComponentLink2Description: https://media.digikey.com/pdf/Data%20Sheets/Sullins%20PDFs/Female_Headers.100_DS.pdf?src-supplier=Digi-Key
P5 P8 = CONN XLR-TRS COMBO 3 POLE: XLR Connectors A SERIES COMBO;3POLE FEM;PCB HOR; Manufacturer_Name: Neutrik; Body Material: Metal; Gender: Female; Current Rating: 3A; Voltage Rating: 50V; Number of Positions: 3; Number of Ports: 1; Number of Contacts: 6; Connector Type: Socket; Datasheet Link: http://www.neutrik.com/zoolu-website/media/download/13540/Product+Guide+-+Section+XLR; Manufacturer_Part_Number: NCJ6FA-H; Mouser Part Number: 568-NCJ6FA-H; Mouser Price/Stock: https://www.mouser.com/Search/Refine.aspx?Keyword=568-NCJ6FA-H; Supplier 1: Mouser; Supplier Part Number 1: 568-NCJ6FA-H; Manufacturer: Neutrik; Stock 1: 3848; Pricing 1: 1 = 2.06000, 10 = 1.96000, 50 = 1.86000, 100 = 1.80000, 1000 = 1.77000, 10000 = 1.77000 (USD); RoHS: Yes; Case/Package: Metal; Number of Pins: 3; Weight: 0.388014oz; Contact Material: Bronze; Contact Plating: Gold; Number of Terminals: 6; Housing Material: Polyamide; Color: Black; Min Operating Temperature: -30°C; Max Operating Temperature: 80°C; Package Quantity: 10; Termination: Solder; Orientation: Horizontal; Length: 25mm; Depth: 30.2mm; REACH SVHC: No SVHC; Flammability Rating: UL94 HB; ComponentLink1URL: https://datasheet.ciiva.com/30126/neutrik-ncj6fa-h-1-30126129.pdf?src-supplier=Onlinecomponents.com; ComponentLink1Description: https://datasheet.ciiva.com/30126/neutrik-ncj6fa-h-1-30126129.pdf?src-supplier=Onlinecomponents.com; ComponentLink2URL: https://datasheet.ciiva.com/8008/76755-8008003.pdf?src-supplier=Element14; ComponentLink2Description: https://datasheet.ciiva.com/8008/76755-8008003.pdf?src-supplier=Element14; ComponentLink3URL: https://datasheet.ciiva.com/24394/neutrik-ncj6fa-h-1-24394955.pdf?src-supplier=Onlinecomponents.com; ComponentLink3Description: https://datasheet.ciiva.com/24394/neutrik-ncj6fa-h-1-24394955.pdf?src-supplier=Onlinecomponents.com
P6 = CONN 30POS HEADER FEMALE 0.1": 30 Position Header Connector 0.100" (2.54mm) Through Hole Tin; Manufacturer: Sullins; Manufacturer Part Number: PPTC152LFBN-RC; Number of Positions: 30; Pitch: 0.1inch; Supplier 1: Digi-Key; RoHS: Yes; Stock 1: 3515; Pricing 1: 1 = 1.82000, 10 = 1.65200, 100 = 1.41560, 500 = 1.17968, 1000 = 1.01115, 5000 = 0.97370 (USD); Mount: Through Hole; Color: Black; Contact Plating: Tin; Contact Material: Bronze; Housing Material: Plastic; Package Quantity: 1000; Number of Rows: 2; Packaging: Bulk; Termination: Solder; Connector Type: Header; Length: 38.6mm; Height: 8.5mm; Row Spacing: 0.1inch; Width: 5mm; Lead Free: Lead Free; ComponentLink1URL: https://media.digikey.com/pdf/Data%20Sheets/Sullins%20PDFs/Female_Headers.100_DS.pdf?src-supplier=Digi-Key; ComponentLink1Description: https://media.digikey.com/pdf/Data%20Sheets/Sullins%20PDFs/Female_Headers.100_DS.pdf?src-supplier=Digi-Key
P7 = CONN 34POS HEADER FEMALE 0.1": 34 Position Header Connector 0.100" (2.54mm) Through Hole Tin; Manufacturer: Sullins; Manufacturer Part Number: PPTC172LFBN-RC; Number of Positions: 34; Pitch: 0.1inch; Supplier 1: Digi-Key; RoHS: Yes; Stock 1: 1849; Pricing 1: 1 = 1.94000, 10 = 1.76400, 100 = 1.51200, 500 = 1.26000, 1000 = 1.08000, 5000 = 1.04000 (USD); Mount: Through Hole; Color: Black; Contact Plating: Tin; Contact Material: Bronze; Housing Material: Plastic; Package Quantity: 1000; Number of Rows: 2; Packaging: Bulk; Termination: Solder; Connector Type: Header; Length: 43.7mm; Height: 8.5mm; Row Spacing: 0.1inch; Width: 5mm; Lead Free: Lead Free; ComponentLink1URL: https://media.digikey.com/pdf/Data%20Sheets/Sullins%20PDFs/Female_Headers.100_DS.pdf?src-supplier=Digi-Key; ComponentLink1Description: https://media.digikey.com/pdf/Data%20Sheets/Sullins%20PDFs/Female_Headers.100_DS.pdf?src-supplier=Digi-Key
P9 = CONN 5POS HEADR MALE 0.1in: 5 Positions Header, Breakaway Connector 0.100" (2.54mm) Through Hole Tin; Manufacturer 1: Molex; Manufacturer Part Number 1: 0022284050; Description 1: Conn Unshrouded Header HDR 5 POS 2.54mm Solder ST Thru-Hole KK® Bag; Contact Resistance: 20mR; Number of Positions: 5; Gender: Male; Connector Type: Male Pin; Max Voltage Rating (AC): 250V; Supplier 1: Digi-Key; Supplier Part Number 1: WM50014-05-ND; Stock 1: 3161; Pricing 1: 1=0.22, 10=0.21, 25=0.1796, 50=0.157, 100=0.1459, 250=0.129, 500=0.1234 (USD); Mount: Through Hole; Colour: Black; Contact Plating: Nickel,Tin; Contact Material: Bronze,Brass; Housing Colour: Black; Housing Material: Nylon; Min Operating Temperature: 0°C; Max Operating Temperature: 75°C; Packaging: Bulk; Number of Rows: 1; Termination: Solder; Number of Contacts: 5; Orientation: Straight; Max Voltage Rating (DC): 250V; Length: 12.7mm; Pitch: 2.54mm; Depth: 2.49mm; Contact Mating Length: 0.24inch; ComponentLink1URL: https://datasheet.ciiva.com/6814/022284363-sd-6814049.pdf; ComponentLink1Description: https://datasheet.ciiva.com/6814/022284363-sd-6814049.pdf; ComponentLink2URL: https://datasheet.ciiva.com/14804/179390022284050-pcb-headers-14804361.pdf; ComponentLink2Description: https://datasheet.ciiva.com/14804/179390022284050-pcb-headers-14804361.pdf; ComponentLink3URL: https://datasheet.ciiva.com/15217/getdatasheetpartid-256138-15217709.pdf; ComponentLink3Description: https://datasheet.ciiva.com/15217/getdatasheetpartid-256138-15217709.pdf
P10 = CONN MICRO-SD ULTRA-LOW 8CKT: 9 (8 + 1) Position Card Connector microSD™ Surface Mount, Right Angle Gold /; Manufacturer: Molex; Gender: Male; Number of Circuits: 8; Pitch: 1.1mm; Supplier 1: Digi-Key; RoHS: Yes; Stock 1: 36042; Pricing 1: 1 = 2.45000, 10 = 2.22400, 25 = 2.08840, 50 = 1.99740, 100 = 1.90670, 250 = 1.72508, 500 = 1.58890 (USD); Mount: Surface Mount; Contact Material: Copper Alloy; Contact Plating: Gold; Housing Material: Polymer; Min Operating Temperature: -25°C; Max Operating Temperature: 85°C; Number of Rows: 1; Package Quantity: 1600; Packaging: Tape and Reel; Connector Type: Connector; Termination: Solder; Orientation: Right Angle; Length: 15.2mm; Depth: 14.95mm; REACH SVHC: No SVHC; Halogen Free: Low Halogen; Supplier Part Number 1: WM12834CT-ND
R22-R30 = RES 10K OHM 1% 1/10W 0603: RES SMD 10K OHM 1% 1/10W 0603; Manufacturer 1: Yageo; Manufacturer Part Number 1: RC0603FR-0710KL; Temperature Coefficient: ±100ppm/°C; Supplier 1: Digi-Key; Supplier Part Number 1: 311-10.0KHRCT-ND; Packaging: Cut Tape (CT); Part Status: Active; Composition: Thick Film; Operating Temperature: -55°C ~ 155°C; Package / Case: 0603 (1608 Metric); Supplier Device Package: 0603; Size / Dimension: 0.063" L x 0.031" W (1.60mm x 0.80mm); Height - Seated (Max): 0.022" (0.55mm); Failure Rate: -; ComponentLink1URL: http://www.yageo.com/documents/recent/PYu-RC_Group_51_RoHS_L_7.pdf; ComponentLink1Description: http://www.yageo.com/documents/recent/PYu-RC_Group_51_RoHS_L_7.pdf; Tolerance: ±1%

## Nets that join several sheets
+5V: MIXR Input System - Buffer (12 pins), MIXR Input System - input (R24.1 TP3.TP)
GND: MIXR Input System - Buffer (22 pins), MIXR Input System - input (23 pins)
PA4: MIXR Input System - Buffer (U1.21), MIXR Input System - input (P4.9)
PB4: MIXR Input System - Buffer (U1.20), MIXR Input System - input (P4.10)
VIN_L_+_BUFF: MIXR Input System - Buffer (R2.1), MIXR Input System - input (P5.2 P5.6 P5.7)
VIN_L_-_BUFF: MIXR Input System - Buffer (R5.1), MIXR Input System - input (P5.3 P5.5)
VIN_R_+_BUFF: MIXR Input System - Buffer (R9.1), MIXR Input System - input (P8.2 P8.6 P8.7)
VIN_R_-_BUFF: MIXR Input System - Buffer (R12.1), MIXR Input System - input (P8.3 P8.5)

## Assembly variants
Standard: not fitted C35 C36